# Altium project FPGA_DB.PrjPcb
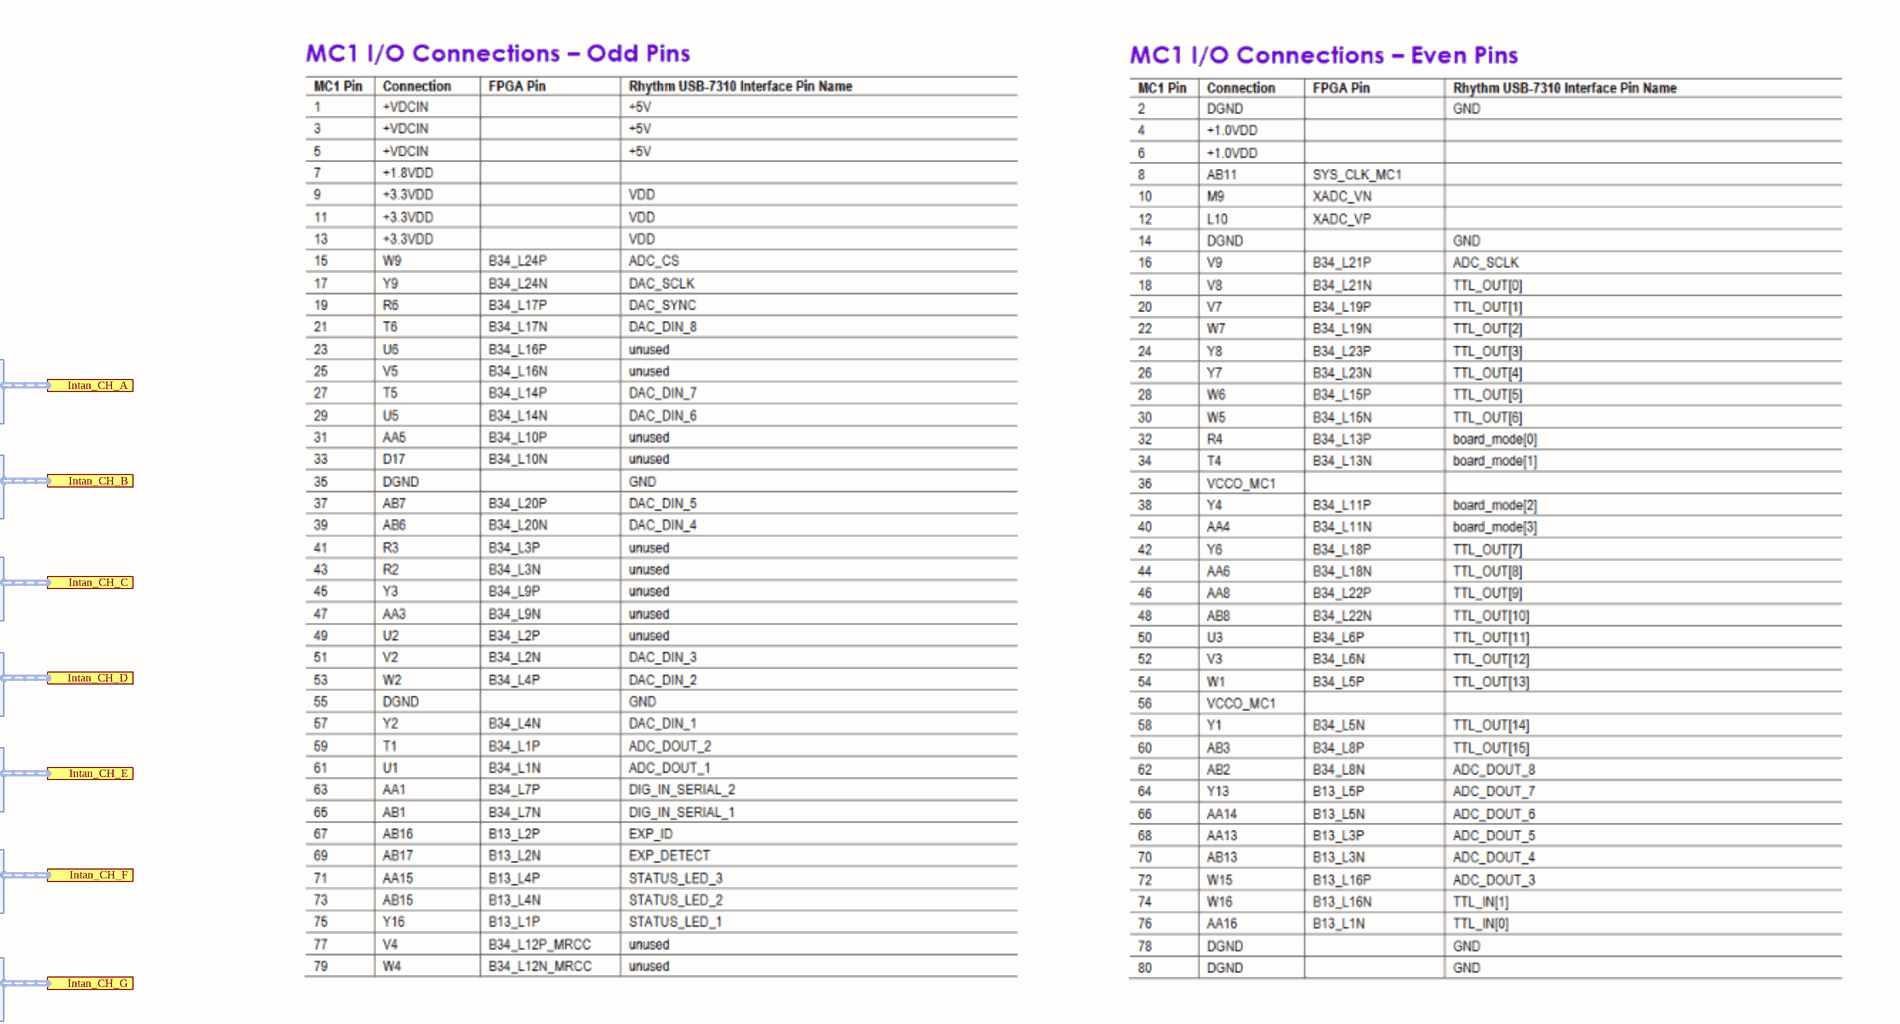
[diagram p0: FPGA.SchDoc, top right]
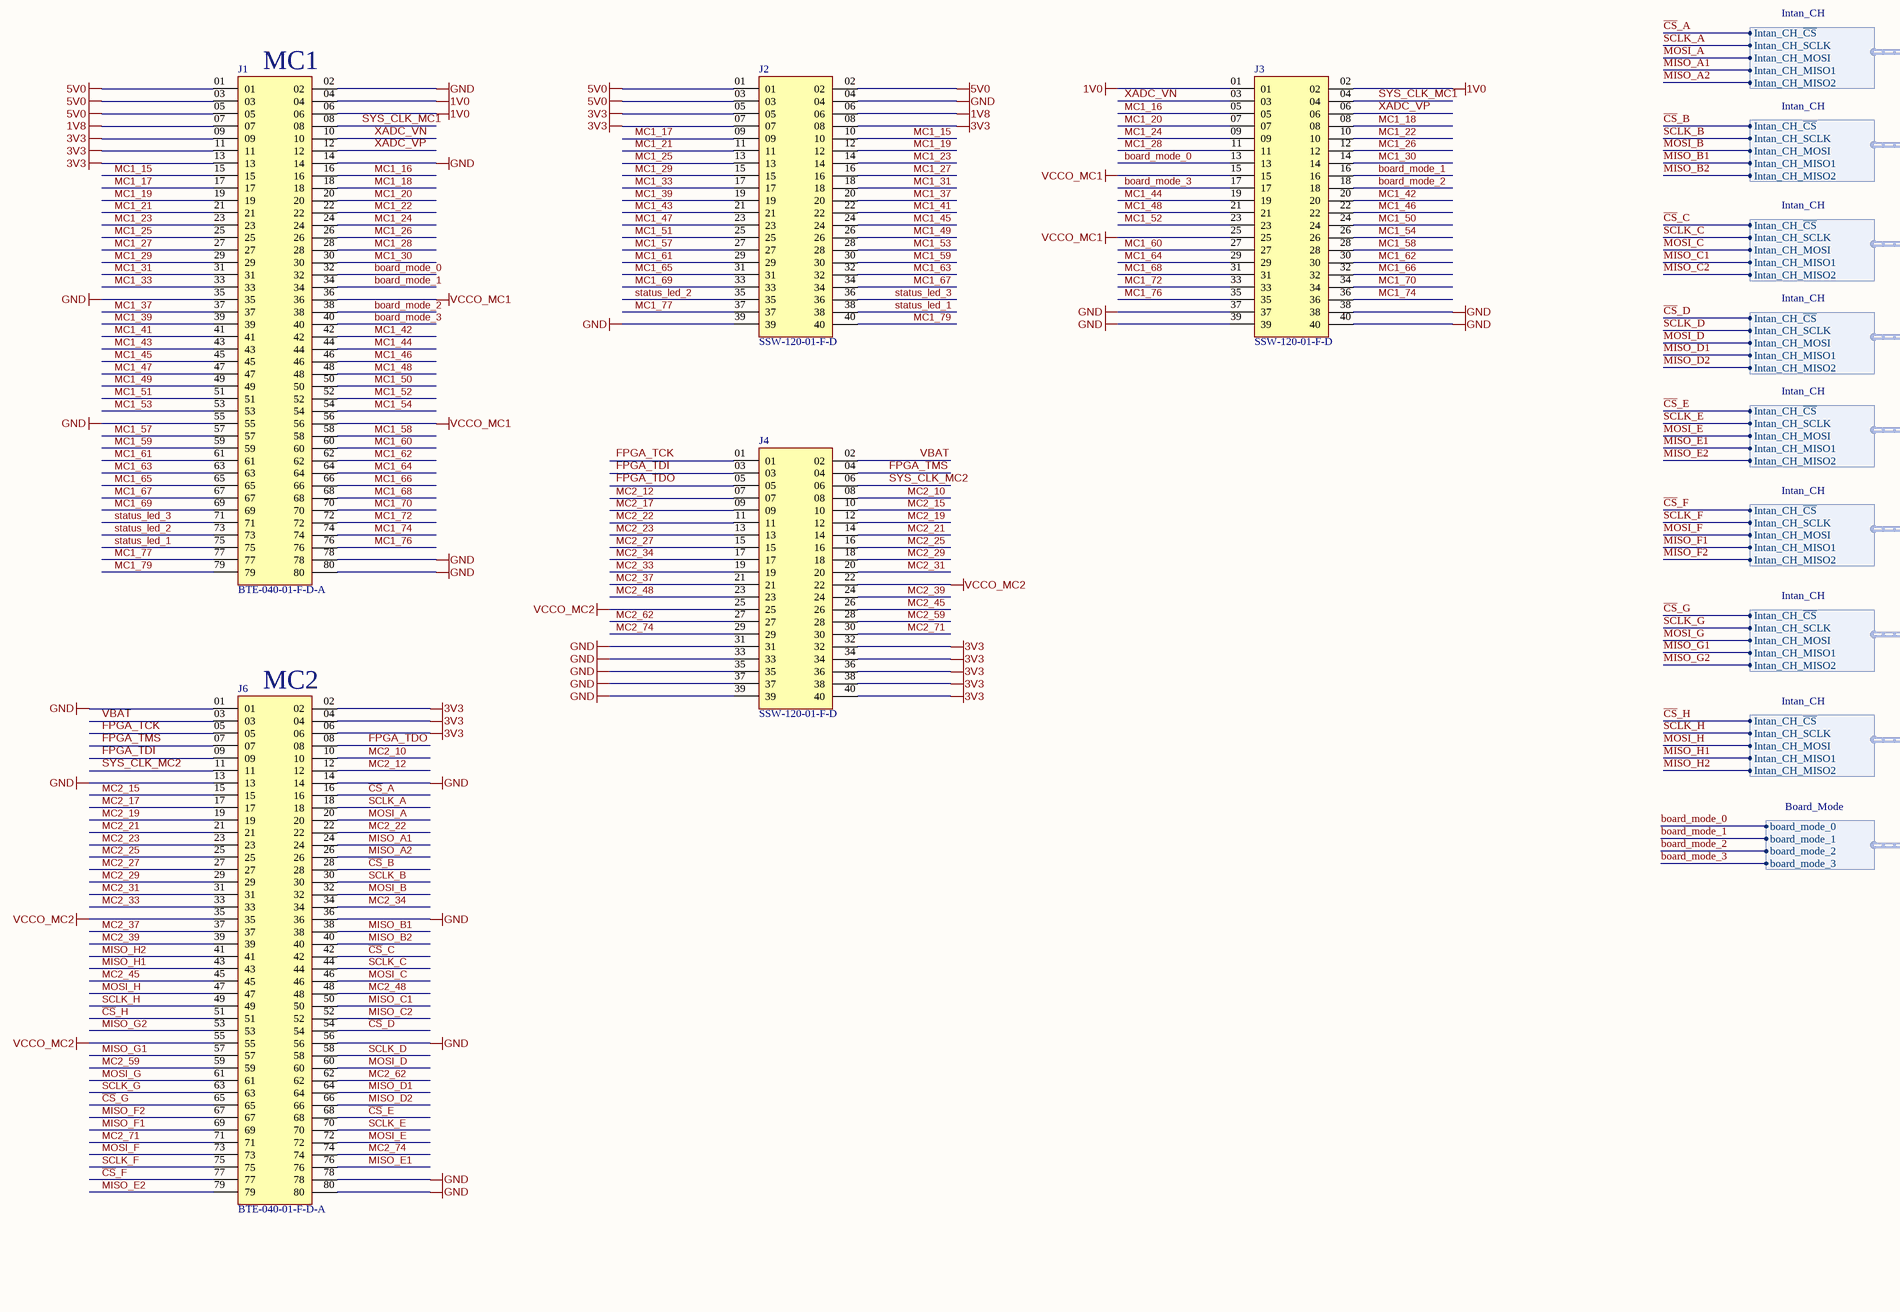
[diagram p1: FPGA.SchDoc, bottom left]
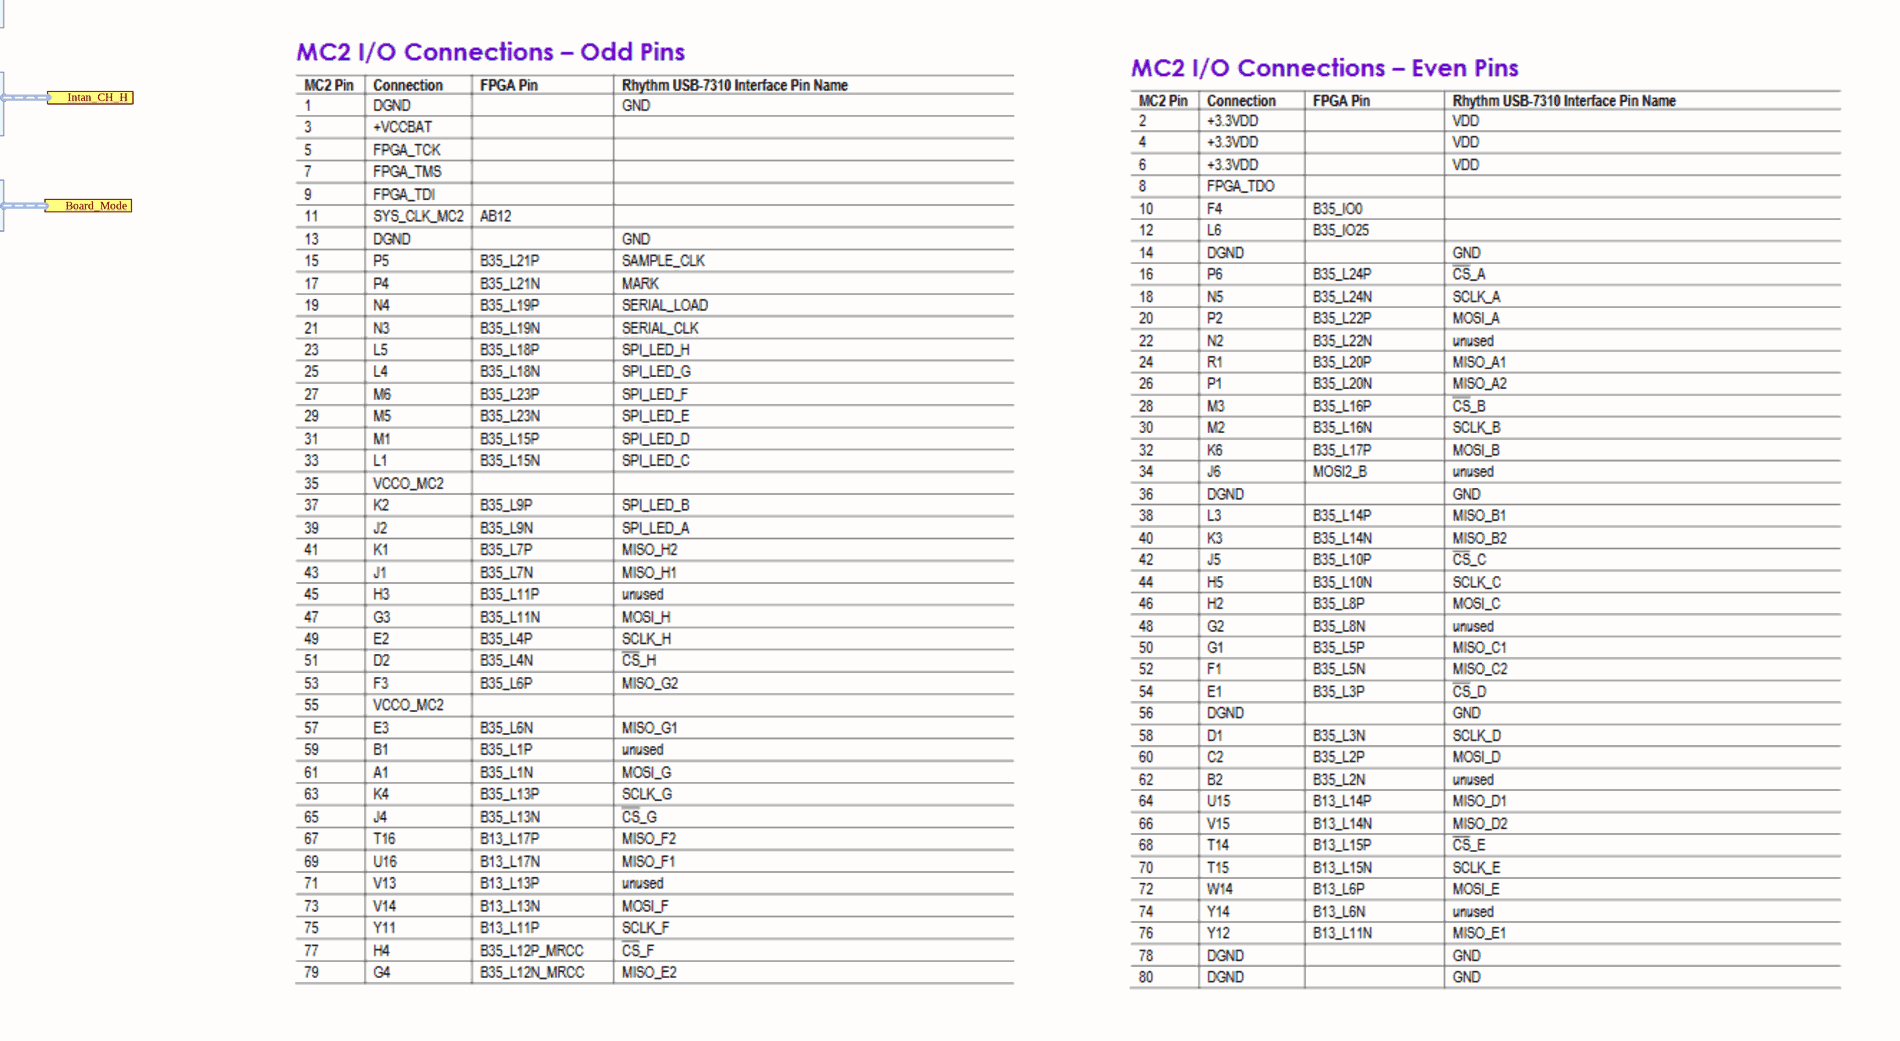
[diagram p2: FPGA.SchDoc, bottom right]
Project_Date: 2026-09-01; Project_DateCode: DC260901; Project_Designer1: Olivier Bergeron; Project_Designer2: Quentin Mascret; Project_Designer3: Benoit Gosselin; Project_Global: UHDEMG; Project_Group: SBioML; Project_Name: FPGA Daughter Board; Project_Revision: 2.000; Project_Stencil_Bot_Thickness: 0.1 MM; Project_Stencil_Top_Thickness: 0.1 MM
2 sheets, 14 parts. Net scope: hierarchical (ports join the sheet entries above them; power ports are global).
Board file: FPGA_DB.PcbDoc
Sheets:
  FPGA.SchDoc
  Onboard_IO.SchDoc

## Sheet FPGA.SchDoc
size Tabloid; SheetNumber: 2; SheetTotal: 5; Sheet_Name: FPGA; Size: 11x17

### Parts
J1  BTE-040-01-F-D-A  [SAMTEC_BTE-040-01-F-D-A]
J2  SSW-120-01-F-D  [SAMTEC_SSW-120-01-F-D]
J3  SSW-120-01-F-D  [SAMTEC_SSW-120-01-F-D]
J4  SSW-120-01-F-D  [SAMTEC_SSW-120-01-F-D]
J6  BTE-040-01-F-D-A  [SAMTEC_BTE-040-01-F-D-A]

### Ports
Board_Mode (harness Board_Mode), Intan_CH_A (harness Intan_CH), Intan_CH_B (harness Intan_CH), Intan_CH_C (harness Intan_CH), Intan_CH_D (harness Intan_CH), Intan_CH_E (harness Intan_CH), Intan_CH_F (harness Intan_CH), Intan_CH_G (harness Intan_CH), Intan_CH_H (harness Intan_CH)

### Harnesses
Board_Mode: board_mode_0, board_mode_1, board_mode_2, board_mode_3
Intan_CH: Intan_CH_~{CS}, Intan_CH_SCLK, Intan_CH_MOSI, Intan_CH_MISO1, Intan_CH_MISO2

### Nets
1V0: J1.04 J1.06 J3.01 J3.02
1V8: J1.07 J2.06
3V3: J1.09 J1.11 J1.13 J2.05 J2.07 J2.08 J4.32 J4.34 J4.36 J4.38 J4.40 J6.02 J6.04 J6.06
5V0: J1.01 J1.03 J1.05 J2.01 J2.02 J2.03
GND: J1.02 J1.14 J1.35 J1.55 J1.78 J1.80 J2.04 J2.39 J3.37 J3.38 J3.39 J3.40 J4.31 J4.33 J4.35 J4.37 J4.39 J6.01 J6.13 J6.14 J6.36 J6.56 J6.78 J6.80
VCCO_MC1: J1.36 J1.56 J3.15 J3.25
VCCO_MC2: J4.22 J4.25 J6.35 J6.55
board_mode_0: J1.32 J3.13 ; port Board_Mode.board_mode_0
board_mode_1: J1.34 J3.16 ; port Board_Mode.board_mode_1
board_mode_2: J1.38 J3.18 ; port Board_Mode.board_mode_2
board_mode_3: J1.40 J3.17 ; port Board_Mode.board_mode_3
~{CS}_A: J6.16 ; port Intan_CH_A.Intan_CH_~{CS}
~{CS}_B: J6.28 ; port Intan_CH_B.Intan_CH_~{CS}
~{CS}_C: J6.42 ; port Intan_CH_C.Intan_CH_~{CS}
~{CS}_D: J6.54 ; port Intan_CH_D.Intan_CH_~{CS}
~{CS}_E: J6.68 ; port Intan_CH_E.Intan_CH_~{CS}
~{CS}_F: J6.77 ; port Intan_CH_F.Intan_CH_~{CS}
~{CS}_G: J6.65 ; port Intan_CH_G.Intan_CH_~{CS}
~{CS}_H: J6.51 ; port Intan_CH_H.Intan_CH_~{CS}
FPGA_TCK: J4.01 J6.05
FPGA_TDI: J4.03 J6.09
FPGA_TDO: J4.05 J6.08
FPGA_TMS: J4.04 J6.07
MC1_15: J1.15 J2.10
MC1_16: J1.16 J3.05
MC1_17: J1.17 J2.09
MC1_18: J1.18 J3.08
MC1_19: J1.19 J2.12
MC1_20: J1.20 J3.07
MC1_21: J1.21 J2.11
MC1_22: J1.22 J3.10
MC1_23: J1.23 J2.14
MC1_24: J1.24 J3.09
MC1_25: J1.25 J2.13
MC1_26: J1.26 J3.12
MC1_27: J1.27 J2.16
MC1_28: J1.28 J3.11
MC1_29: J1.29 J2.15
MC1_30: J1.30 J3.14
MC1_31: J1.31 J2.18
MC1_33: J1.33 J2.17
MC1_37: J1.37 J2.20
MC1_39: J1.39 J2.19
MC1_41: J1.41 J2.22
MC1_42: J1.42 J3.20
MC1_43: J1.43 J2.21
MC1_44: J1.44 J3.19
MC1_45: J1.45 J2.24
MC1_46: J1.46 J3.22
MC1_47: J1.47 J2.23
MC1_48: J1.48 J3.21
MC1_49: J1.49 J2.26
MC1_50: J1.50 J3.24
MC1_51: J1.51 J2.25
MC1_52: J1.52 J3.23
MC1_53: J1.53 J2.28
MC1_54: J1.54 J3.26
MC1_57: J1.57 J2.27
MC1_58: J1.58 J3.28
MC1_59: J1.59 J2.30
MC1_60: J1.60 J3.27
MC1_61: J1.61 J2.29
MC1_62: J1.62 J3.30
MC1_63: J1.63 J2.32
MC1_64: J1.64 J3.29
MC1_65: J1.65 J2.31
MC1_66: J1.66 J3.32
MC1_67: J1.67 J2.34
MC1_68: J1.68 J3.31
MC1_69: J1.69 J2.33
MC1_70: J1.70 J3.34
MC1_72: J1.72 J3.33
MC1_74: J1.74 J3.36
MC1_76: J1.76 J3.35
MC1_77: J1.77 J2.37
MC1_79: J1.79 J2.40
MC2_10: J4.08 J6.10
MC2_12: J4.07 J6.12
MC2_15: J4.10 J6.15
MC2_17: J4.09 J6.17
MC2_19: J4.12 J6.19
MC2_21: J4.14 J6.21
MC2_22: J4.11 J6.22
MC2_23: J4.13 J6.23
MC2_25: J4.16 J6.25
MC2_27: J4.15 J6.27
MC2_29: J4.18 J6.29
MC2_31: J4.20 J6.31
MC2_33: J4.19 J6.33
MC2_34: J4.17 J6.34
MC2_37: J4.21 J6.37
MC2_39: J4.24 J6.39
MC2_45: J4.26 J6.45
MC2_48: J4.23 J6.48
MC2_59: J4.28 J6.59
MC2_62: J4.27 J6.62
MC2_71: J4.30 J6.71
MC2_74: J4.29 J6.74
MISO_A1: J6.24 ; port Intan_CH_A.Intan_CH_MISO1
MISO_A2: J6.26 ; port Intan_CH_A.Intan_CH_MISO2
MISO_B1: J6.38 ; port Intan_CH_B.Intan_CH_MISO1
MISO_B2: J6.40 ; port Intan_CH_B.Intan_CH_MISO2
MISO_C1: J6.50 ; port Intan_CH_C.Intan_CH_MISO1
MISO_C2: J6.52 ; port Intan_CH_C.Intan_CH_MISO2
MISO_D1: J6.64 ; port Intan_CH_D.Intan_CH_MISO1
MISO_D2: J6.66 ; port Intan_CH_D.Intan_CH_MISO2
MISO_E1: J6.76 ; port Intan_CH_E.Intan_CH_MISO1
MISO_E2: J6.79 ; port Intan_CH_E.Intan_CH_MISO2
MISO_F1: J6.69 ; port Intan_CH_F.Intan_CH_MISO1
MISO_F2: J6.67 ; port Intan_CH_F.Intan_CH_MISO2
MISO_G1: J6.57 ; port Intan_CH_G.Intan_CH_MISO1
MISO_G2: J6.53 ; port Intan_CH_G.Intan_CH_MISO2
MISO_H1: J6.43 ; port Intan_CH_H.Intan_CH_MISO1
MISO_H2: J6.41 ; port Intan_CH_H.Intan_CH_MISO2
MOSI_A: J6.20 ; port Intan_CH_A.Intan_CH_MOSI
MOSI_B: J6.32 ; port Intan_CH_B.Intan_CH_MOSI
MOSI_C: J6.46 ; port Intan_CH_C.Intan_CH_MOSI
MOSI_D: J6.60 ; port Intan_CH_D.Intan_CH_MOSI
MOSI_E: J6.72 ; port Intan_CH_E.Intan_CH_MOSI
MOSI_F: J6.73 ; port Intan_CH_F.Intan_CH_MOSI
MOSI_G: J6.61 ; port Intan_CH_G.Intan_CH_MOSI
MOSI_H: J6.47 ; port Intan_CH_H.Intan_CH_MOSI
SCLK_A: J6.18 ; port Intan_CH_A.Intan_CH_SCLK
SCLK_B: J6.30 ; port Intan_CH_B.Intan_CH_SCLK
SCLK_C: J6.44 ; port Intan_CH_C.Intan_CH_SCLK
SCLK_D: J6.58 ; port Intan_CH_D.Intan_CH_SCLK
SCLK_E: J6.70 ; port Intan_CH_E.Intan_CH_SCLK
SCLK_F: J6.75 ; port Intan_CH_F.Intan_CH_SCLK
SCLK_G: J6.63 ; port Intan_CH_G.Intan_CH_SCLK
SCLK_H: J6.49 ; port Intan_CH_H.Intan_CH_SCLK
status_led_1: J1.75 J2.38
status_led_2: J1.73 J2.35
status_led_3: J1.71 J2.36
SYS_CLK_MC1: J1.08 J3.04
SYS_CLK_MC2: J4.06 J6.11
VBAT: J4.02 J6.03
XADC_VN: J1.10 J3.03
XADC_VP: J1.12 J3.06

### Notes on the sheet
- (near J1) MC1
- (near J6) MC2
- Sheet Name
- Project Title
- Global Project
- Size
- Group
- Revision
- Date
- Sheet
- of
- Filename
- Designers

### Library data of the parts
J1 J6 = CON_FPGA_SMD: 80 Position Connector Header, Outer Shroud Contacts Surface Mount Gold; MF: Samtec; MP: BTE-040-01-F-D-A; Value: *; Package: None; Price: None; Availability: Unavailable
J2-J4 = CON_HEADF_2X20: 40 Position Receptacle Connector 0.100" (2.54mm) Through Hole Gold; MF: Samtec; Package: None; Availability: Unavailable; Value: *; MP: SSW-120-01-F-D; Price: None

## Sheet Onboard_IO.SchDoc
size Tabloid; SheetNumber: 3; SheetTotal: 5; Sheet_Name: Onboard IO; Size: 11x17
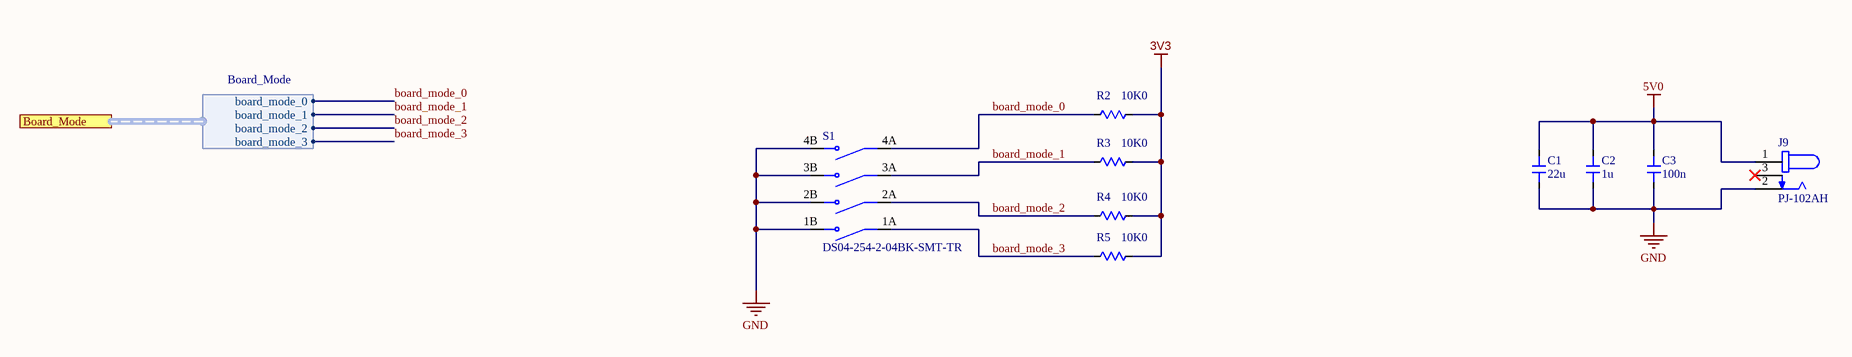
[diagram p3: Onboard_IO.SchDoc]

### Parts
C1  22u  [0805_CAPACITOR]
C2  1u  [0603_CAPACITOR]
C3  100n  [0603_CAPACITOR]
J9  PJ-102AH  [CUI_PJ-102AH]
R2  10K0  [0603_RESISTOR]
R3  10K0  [0603_RESISTOR]
R4  10K0  [0603_RESISTOR]
R5  10K0  [0603_RESISTOR]
S1  DS04-254-2-04BK-SMT-TR  [SW_DS04-254-2-04BK-SMT-TR]

### Ports
Board_Mode (harness Board_Mode)

### Harnesses
Board_Mode: board_mode_0, board_mode_1, board_mode_2, board_mode_3

### Nets
3V3: R2.2 R3.2 R4.2 R5.2
5V0: C1.2 C2.2 C3.2 J9.1
GND: C1.1 C2.1 C3.1 J9.2 S1.1B(NO1) S1.2B(NO2) S1.3B(NO3) S1.4B(NO4)
board_mode_0: R2.1 S1.4A(COM4) ; port Board_Mode.board_mode_0
board_mode_1: R3.1 S1.3A(COM3) ; port Board_Mode.board_mode_1
board_mode_2: R4.1 S1.2A(COM2) ; port Board_Mode.board_mode_2
board_mode_3: R5.1 S1.1A(COM1) ; port Board_Mode.board_mode_3

Not connected (* = marked no-connect by the designer): J9 3*

### Notes on the sheet
- Sheet Name
- Project Title
- Global Project
- Size
- Group
- Revision
- Date
- Sheet
- of
- Filename
- Designers

### Library data of the parts
C1-C3 = Capacitor
J9 = CON_PWR_24V_5A: Power Barrel Connector Jack 2.00mm ID (0.079"), 5.50mm OD (0.217") Through Hole, Right Angle; MF: Same Sky; SnapEDA_Link: https://www.snapeda.com/parts/PJ-102AH/Same+Sky/view-part/?ref=snap; Package: None; Value: *; MP: PJ-102AH; Check_prices: https://www.snapeda.com/parts/PJ-102AH/Same+Sky/view-part/?ref=eda
R2-R5 = Resistor: GRAMS Lib Spec: 2.7
S1 = SW_DIP_4_SMT: Dip Switch SPST 4 Position Surface Mount Slide (Standard) Actuator 25mA 24VDC; MF: Same Sky; SnapEDA_Link: https://www.snapeda.com/parts/DS04-254-2-04BK-SMT-TR/Same+Sky/view-part/?ref=snap; Package: None; Value: *; MP: DS04-254-2-04BK-SMT-TR; Check_prices: https://www.snapeda.com/parts/DS04-254-2-04BK-SMT-TR/Same+Sky/view-part/?ref=eda

## Nets that join several sheets
3V3: FPGA (14 pins), Onboard_IO (R2.2 R3.2 R4.2 R5.2)
5V0: FPGA (6 pins), Onboard_IO (C1.2 C2.2 C3.2 J9.1)
GND: FPGA (24 pins), Onboard_IO (8 pins)